# Altium schematic sheet MB2146-07-E.SchDoc
size A2
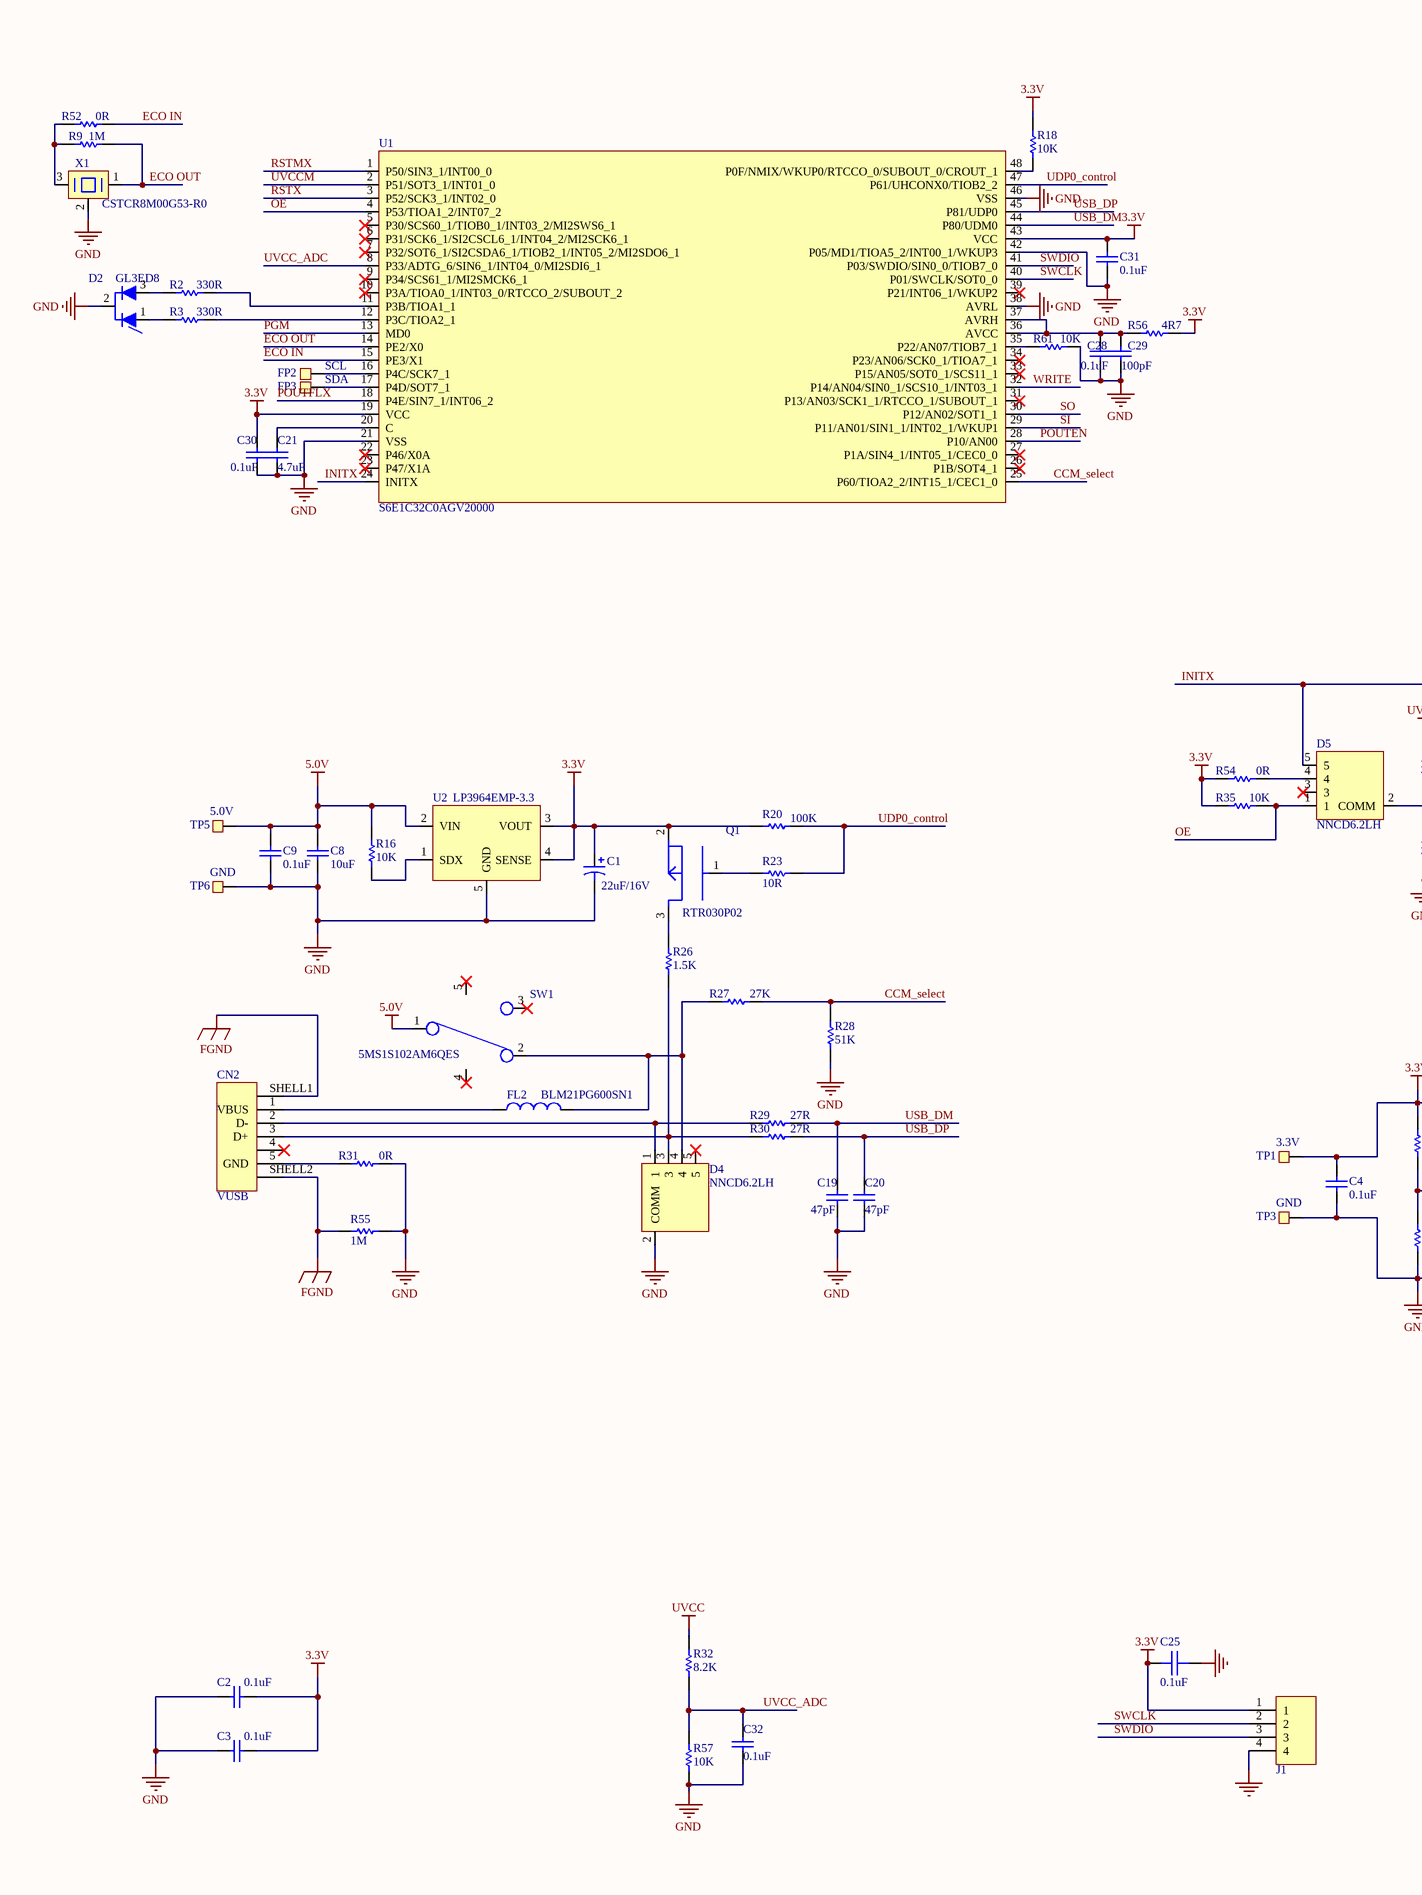
[diagram p0: MB2146-07-E.SchDoc, left]
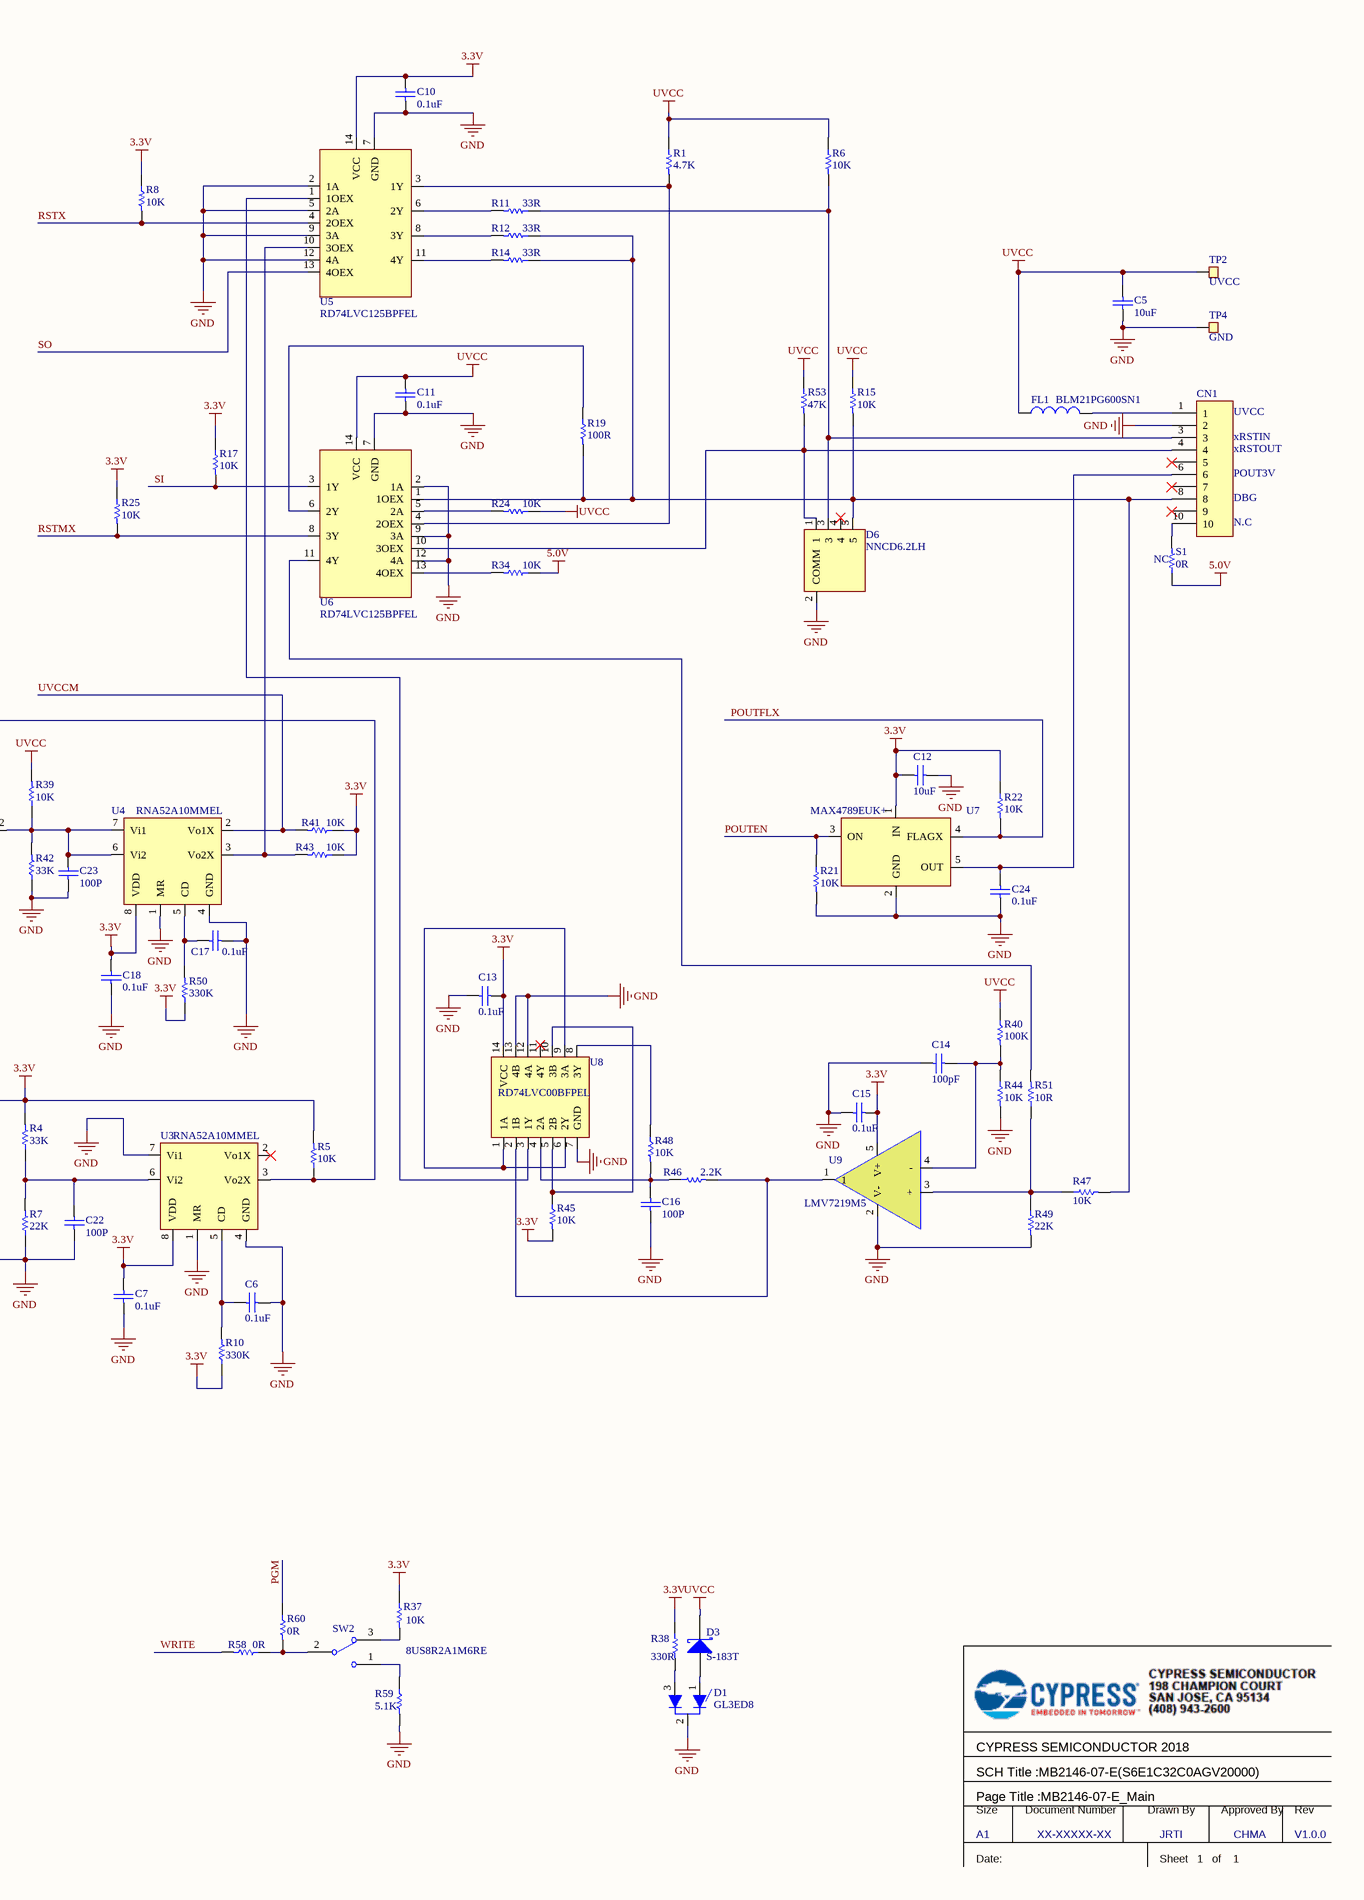
[diagram p1: MB2146-07-E.SchDoc, right]

## Parts
C1  value 22uF/16V  [EMVS_E46]  (hidden comment: Cap Pol3)
C2  value 0.1uF  [0603]  (hidden comment: Cap)
C3  value 0.1uF  [0603]  (hidden comment: Cap)
C4  value 0.1uF  [0603]  (hidden comment: Cap)
C5  value 10uF  [1206]  (hidden comment: Cap)
C6  value 0.1uF  [0603]  (hidden comment: Cap)
C7  value 0.1uF  [0603]  (hidden comment: Cap)
C8  value 10uF  [1206]  (hidden comment: Cap)
C9  value 0.1uF  [0603]  (hidden comment: Cap)
C10  value 0.1uF  [C0603]  (hidden comment: Cap)
C11  value 0.1uF  [0603]  (hidden comment: Cap)
C12  value 10uF  [1206]  (hidden comment: Cap)
C13  value 0.1uF  [0603]  (hidden comment: Cap)
C14  value 100pF  [0603]  (hidden comment: Cap)
C15  value 0.1uF  [0603]  (hidden comment: Cap)
C16  value 100P  [0603]  (hidden comment: Cap)
C17  value 0.1uF  [0603]  (hidden comment: Cap)
C18  value 0.1uF  [0603]  (hidden comment: Cap)
C19  value 47pF  [0603]  (hidden comment: Cap)
C20  value 47pF  [0603]  (hidden comment: Cap)
C21  value 4.7uF  [0603]  (hidden comment: Cap)
C22  value 100P  [0603]  (hidden comment: Cap)
C23  value 100P  [0603]  (hidden comment: Cap)
C24  value 0.1uF  [0603]  (hidden comment: Cap)
C25  0.1uF  [0603]
C28  value 0.1uF  [0603]  (hidden comment: Cap)
C29  value 100pF  [0603]  (hidden comment: Cap)
C30  value 0.1uF  [0603]  (hidden comment: Cap)
C31  value 0.1uF  [0603]  (hidden comment: Cap)
C32  value 0.1uF  [0603]  (hidden comment: Cap)
CN1  Header 10H  [FAP-10-08]  (value not drawn)
CN2  VUSB  [USB_CN01]
D1  GL3ED8  [GL3ED8]
D2  GL3ED8  [GL3ED8]
D3  S-183T  [S_183T]
D4  NNCD6.2LH  [NNCD6_2LH]
D5  NNCD6.2LH  [NNCD6_2LH]
D6  NNCD6.2LH  [NNCD6_2LH]
FL1  BLM21PG600SN1  [0805]
FL2  BLM21PG600SN1  [0805]
FP2  SCL  [TP_8G]
FP3  SDA  [TP_8G]
J1  J1  [SWD_4_2.54]  (value not drawn)
Q1  RTR030P02  [TSMT3_0]
R1  value 4.7K  [0603]  (hidden comment: Res1)
R2  value 330R  [0603]  (hidden comment: Res1)
R3  value 330R  [0603]  (hidden comment: Res1)
R4  value 33K  [0603]  (hidden comment: Res1)
R5  value 10K  [0603]  (hidden comment: Res1)
R6  value 10K  [0603]  (hidden comment: Res1)
R7  value 22K  [0603]  (hidden comment: Res1)
R8  value 10K  [0603]  (hidden comment: Res1)
R9  value 1M  [0603]  (hidden comment: Res1)
R10  value 330K  [0603]  (hidden comment: Res1)
R11  value 33R  [0603]  (hidden comment: Res1)
R12  value 33R  [0603]  (hidden comment: Res1)
R14  value 33R  [0603]  (hidden comment: Res1)
R15  value 10K  [0603]  (hidden comment: Res1)
R16  value 10K  [0603]  (hidden comment: Res1)
R17  value 10K  [0603]  (hidden comment: Res1)
R18  value 10K  [0603]  (hidden comment: Res1)
R19  value 100R  [0603]  (hidden comment: Res1)
R20  value 100K  [0603]  (hidden comment: Res1)
R21  value 10K  [0603]  (hidden comment: Res1)
R22  value 10K  [0603]  (hidden comment: Res1)
R23  value 10R  [0603]  (hidden comment: Res1)
R24  value 10K  [0603]  (hidden comment: Res1)
R25  value 10K  [0603]  (hidden comment: Res1)
R26  value 1.5K  [0603]  (hidden comment: Res1)
R27  value 27K  [0603]  (hidden comment: Res1)
R28  value 51K  [0603]  (hidden comment: Res1)
R29  value 27R  [0603]  (hidden comment: Res1)
R30  value 27R  [0603]  (hidden comment: Res1)
R31  value 0R  [0603]  (hidden comment: Res1)
R32  value 8.2K  [0603]  (hidden comment: Res1)
R34  value 10K  [0603]  (hidden comment: Res1)
R35  value 10K  [0603]  (hidden comment: Res1)
R37  value 10K  [0603]  (hidden comment: Res1)
R38  value 330R  [0603]  (hidden comment: Res1)
R39  value 10K  [0603]  (hidden comment: Res1)
R40  value 100K  [0603]  (hidden comment: Res1)
R41  value 10K  [0603]  (hidden comment: Res1)
R42  value 33K  [0603]  (hidden comment: Res1)
R43  value 10K  [0603]  (hidden comment: Res1)
R44  value 10K  [0603]  (hidden comment: Res1)
R45  value 10K  [0603]  (hidden comment: Res1)
R46  value 2.2K  [0603]  (hidden comment: Res1)
R47  value 10K  [0603]  (hidden comment: Res1)
R48  value 10K  [0603]  (hidden comment: Res1)
R49  value 22K  [0603]  (hidden comment: Res1)
R50  value 330K  [0603]  (hidden comment: Res1)
R51  value 10R  [0603]  (hidden comment: Res1)
R52  value 0R  [0603]  (hidden comment: Res1)
R53  value 47K  [0603]  (hidden comment: Res1)
R54  value 0R  [0603]  (hidden comment: Res1)
R55  value 1M  [0603]  (hidden comment: Res1)
R56  value 4R7  [0603]  (hidden comment: Res1)
R57  value 10K  [0603]  (hidden comment: Res1)
R58  value 0R  [0603]  (hidden comment: Res1)
R59  value 5.1K  [0603]  (hidden comment: Res1)
R60  value 0R  [0603]  (hidden comment: Res1)
R61  value 10K  [0603]  (hidden comment: Res1)
S1  NC  value 0R  [FFC_2]
SW1  5MS1S102AM6QES  [5MS1S102AM6QES]
SW2  8US8R2A1M6RE  [M6RE]
TP1  3.3V  [TP_8G]
TP2  UVCC  [TP_8G]
TP3  GND  [TP_8G]
TP4  GND  [TP_8G]
TP5  5.0V  [TP_8G]
TP6  GND  [TP_8G]
U1  S6E1C32C0AGV20000  [LQFP48]
U2  LP3964EMP-3.3  [SOT223_5]
U3  RNA52A10MMEL  [SOP8]
U4  RNA52A10MMEL  [SOP8]
U5  RD74LVC125BPFEL  [SOP14]
U6  RD74LVC125BPFEL  [SOP14]
U7  MAX4789EUK+  [SOT23_5L]
U8  RD74LVC00BFPEL  [SOP14]
U9  LMV7219M5  [SOT23_5]
X1  CSTCR8M00G53-R0  [CSTCR]

## Nets
3.3V: C1.1 C2.2 C3.2 C4.2 C7.2 C10.1 C12.2 C13.2 C15.2 C18.1 C25.1 C30.2 C31.2 J1.1 Q1.2 R4.2 R5.2 R8.1 R10.1 R17.1 R18.2 R20.2 R22.1 R25.1 R35.1 R37.1 R38.1 R41.1 R43.1 R45.2 R50.1 R54.2 R56.1 TP1.?1 U1.19(VCC) U1.43(VCC) U2.3(VOUT) U2.4(SENSE) U3.8(VDD) U4.8(VDD) U5.14(VCC) U7.1(IN) U8.14(VCC) U9.5(V+)
5.0V: C8.2 C9.2 R16.2 R34.1 S1.1 SW1.1 TP5.?1 U2.2(VIN)
FGND: CN2.SHELL1 CN2.SHELL2 R55.2
GND: C1.2 C2.1 C3.1 C4.1 C5.2 C6.1 C7.1 C8.1 C9.1 C10.2 C11.2 C12.1 C13.1 C14.1 C15.1 C16.1 C17.1 C18.2 C19.1 C20.1 C21.1 C22.1 C23.1 C24.2 C25.2 C28.1 C29.1 C30.1 C31.1 C32.1 CN1.2 D1.2 D2.2 D4.2(COMM) D6.2(COMM) J1.4 R7.1 R21.2 R28.2 R31.1 R42.1 R44.2 R49.2 R55.1 R57.1 R59.2 R61.1 TP3.?1 TP4.?1 TP6.?1 U1.21(VSS) U1.38(AVRL) U1.42(P05/MD1/TIOA5_2/INT00_1/WKUP3) U1.46(VSS) U2.5(GND) U3.1(MR) U3.4(GND) U3.7(Vi1) U4.1(MR) U4.4(GND) U5.2(1A) U5.5(2A) U5.7(GND) U5.9(3A) U5.12(4A) U6.2(1A) U6.7(GND) U6.9(3A) U6.12(4A) U7.2(GND) U8.7(GND) U8.12(4A) U8.13(4B) U9.2(V-) X1.2
UVCC: C5.1 C11.1 D3.2(K) FL1.1 R1.1 R6.1 R15.1 R24.1 R32.2 R39.2 R40.1 R53.1 TP2.?1 U6.14(VCC)
CCM_select: R27.2 R28.1 U1.25(P60/TIOA2_2/INT15_1/CEC1_0)
ECO IN: R52.1 U1.15(PE3/X1)
ECO OUT: R9.1 U1.14(PE2/X0) X1.1
INITX: D5.5 R5.1 U1.24(INITX) U3.3(Vo2X)
OE: D5.1 R35.2 U1.4(P53/TIOA1_2/INT07_2)
PGM: R60.1 U1.13(MD0)
POUTEN: R21.1 U1.28(P10/AN00) U7.3(ON)
POUTFLX: R22.2 U1.18(P4E/SIN7_1/INT06_2) U7.4(FLAGX)
RSTMX: R25.2 U1.1(P50/SIN3_1/INT00_0) U6.8(3Y)
RSTX: R8.2 U1.3(P52/SCK3_1/INT02_0) U5.4(2OEX)
SI: R17.2 U1.29(P11/AN01/SIN1_1/INT02_1/WKUP1) U6.3(1Y)
SO: U1.30(P12/AN02/SOT1_1) U5.13(4OEX)
SWCLK: J1.2 U1.40(P01/SWCLK/SOT0_0)
SWDIO: J1.3 U1.41(P03/SWDIO/SIN0_0/TIOB7_0)
UDP0_control: R20.1 R23.1 U1.47(P61/UHCONX0/TIOB2_2)
USB_DM: C19.2 R29.1 U1.44(P80/UDM0)
USB_DP: C20.2 R30.1 U1.45(P81/UDP0)
UVCC_ADC: C32.2 R32.1 R57.2 U1.8(P33/ADTG_6/SIN6_1/INT04_0/MI2SDI6_1)
UVCCM: R41.2 U1.2(P51/SOT3_1/INT01_0) U4.2(Vo1X)
WRITE: R58.2 U1.32(P14/AN04/SIN0_1/SCS10_1/INT03_1)
NetC6_2: C6.2 R10.2 U3.5(CD)
NetC14_2: C14.2 R40.2 R44.1 U9.4(-)
NetC16_2: C16.2 R46.1 R48.2 U8.4(2A)
NetC17_2: C17.2 R50.2 U4.5(CD)
NetC21_2: C21.2 U1.20(C)
NetC22_2: C22.2 R4.1 R7.2 U3.6(Vi2)
NetC23_2: C23.2 D5.2(COMM) R39.1 R42.2 U4.6(Vi2) U4.7(Vi1)
NetC24_1: C24.1 CN1.6 U7.5(OUT)
NetC28_2: C28.2 C29.2 R56.2 U1.36(AVCC) U1.37(AVRH)
NetCN1_1: CN1.1 FL1.2
NetCN1_3: CN1.3 D6.3 R6.2 R11.1
NetCN1_4: CN1.4 D6.1 R53.2 U6.10(3OEX)
NetCN1_8: CN1.8 D6.5 R12.1 R14.1 R15.2 R19.2 R47.2 U6.1(1OEX)
NetCN1_10: CN1.10 S1.2
NetCN2_1: CN2.1(VBUS) FL2.1
NetCN2_2: CN2.2(D-) D4.1 R29.2
NetCN2_3: CN2.3(D+) D4.3 R26.2 R30.2
NetCN2_5: CN2.5(GND) R31.2
NetD1_1: D1.1 D3.1(A)
NetD1_3: D1.3 R38.2
NetD2_1: D2.1 R3.2
NetD2_3: D2.3 R2.2
NetD4_4: D4.4 FL2.2 R27.1 SW1.2
NetD5_4: D5.4 R54.1
NetFP2_?1: FP2.?1 U1.16(P4C/SCK7_1)
NetFP3_?1: FP3.?1 U1.17(P4D/SOT7_1)
NetQ1_1: Q1.1 R23.2
NetQ1_3: Q1.3 R26.1
NetR1_2: R1.2 U5.3(1Y) U6.4(2OEX)
NetR2_1: R2.1 U1.11(P3B/TIOA1_1)
NetR3_1: R3.1 U1.12(P3C/TIOA2_1)
NetR9_2: R9.2 R52.2 X1.3
NetR11_2: R11.2 U5.6(2Y)
NetR12_2: R12.2 U5.8(3Y)
NetR14_2: R14.2 U5.11(4Y)
NetR16_1: R16.1 U2.1(SDX)
NetR18_1: R18.1 U1.48(P0F/NMIX/WKUP0/RTCCO_0/SUBOUT_0/CROUT_1)
NetR19_1: R19.1 U6.6(2Y)
NetR24_2: R24.2 U6.5(2A)
NetR34_2: R34.2 U6.13(4OEX)
NetR37_2: R37.2 SW2.3
NetR43_2: R43.2 U4.3(Vo2X) U5.10(3OEX)
NetR45_1: R45.1 U8.5(2B) U8.10(3B)
NetR46_2: R46.2 U8.2(1B) U9.1
NetR47_1: R47.1 R49.1 R51.1 U9.3(+)
NetR48_1: R48.1 U8.8(3Y)
NetR51_2: R51.2 U6.11(4Y)
NetR58_1: R58.1 R60.2 SW2.2
NetR59_1: R59.1 SW2.1
NetR61_2: R61.2 U1.35(P22/AN07/TIOB7_1)
NetU5_1: U5.1(1OEX) U8.3(1Y)
NetU8_1: U8.1(1A) U8.6(2Y) U8.9(3A)

Not connected (* = marked no-connect by the designer): CN1 5* 7* 9*; CN2 4*; D4 5*; D5 3*; D6 4*; SW1 3* 4* 5*; U1 5(P30/SCS60_1/TIOB0_1/INT03_2/MI2SWS6_1)* 6(P31/SCK6_1/SI2CSCL6_1/INT04_2/MI2SCK6_1)* 7(P32/SOT6_1/SI2CSDA6_1/TIOB2_1/INT05_2/MI2SDO6_1)* 9(P34/SCS61_1/MI2SMCK6_1)* 10(P3A/TIOA0_1/INT03_0/RTCCO_2/SUBOUT_2)* 22(P46/X0A)* 23(P47/X1A)* 26(P1B/SOT4_1)* 27(P1A/SIN4_1/INT05_1/CEC0_0)* 31(P13/AN03/SCK1_1/RTCCO_1/SUBOUT_1)* 33(P15/AN05/SOT0_1/SCS11_1)* 34(P23/AN06/SCK0_1/TIOA7_1)* 39(P21/INT06_1/WKUP2)*; U3 2(Vo1X)*; U8 11(4Y)*

## Notes on the sheet
- (near CN1) UVCC
- (near CN1) xRSTIN
- (near CN1) xRSTOUT
- (near CN1) POUT3V
- (near CN1) DBG
- (near CN1) N.C
- CYPRESS SEMICONDUCTOR 2018
- SCH Title :MB2146-07-E(S6E1C32C0AGV20000)
- Page Title :MB2146-07-E_Main
- Size
- Date:
- A1
- Document Number
- XX-XXXXX-XX
- Drawn By
- Sheet   1   of    1
- JRTI
- Approved By
- CHMA
- Rev
- V1.0.0

## Library data of the parts
C1 = Cap Pol3: Polarized Capacitor (Surface Mount); Published: 8-Jun-2000; LatestRevisionDate: 17-Jul-2002; LatestRevisionNote: Re-released for DXP Platform.; PackageReference: C0805; Publisher: Altium Limited
C2-C24 C28-C32 = Cap: Capacitor; Published: 8-Jun-2000; LatestRevisionDate: 17-Jul-2002; LatestRevisionNote: Re-released for DXP Platform.; PackageReference: RAD-0.3; Publisher: Altium Limited
C25 = C_no pol: Capacitor without polarity
CN1 = Header 10H: Header, 10-Pin, Right Angle; LatestRevisionDate: 17-Jul-2002; LatestRevisionNote: Re-released for DXP Platform.; Publisher: Altium Limited
CN2 = Header 7H: Header, 7-Pin, Right Angle; LatestRevisionDate: 17-Jul-2002; LatestRevisionNote: Re-released for DXP Platform.; Publisher: Altium Limited
D3 = D Schottky: Schottky Diode; Published: 8-Jun-2000; LatestRevisionDate: 17-Jul-2002; LatestRevisionNote: Re-released for DXP Platform.; PackageReference: SMB; Publisher: Altium Limited; Code_JEDEC: DO-214-AA
FL1 FL2 = Inductor: Code_IEC: 1005; Value: 10mH; Published: 8-Jun-2000; LatestRevisionDate: 17-Jul-2002; LatestRevisionNote: Re-released for DXP Platform.; PackageReference: 0402-A; Publisher: Altium Limited; Code_JEITA: 0402
FP2 FP3 TP1-TP6 = TP
J1 = Header 4: Header, 4-Pin; LatestRevisionDate: 17-Jul-2002; LatestRevisionNote: Re-released for DXP Platform.; Publisher: Altium Limited
R1-R12 R14-R32 R34 R35 R37-R61 S1 = Res1: Resistor; Published: 8-Jun-2000; LatestRevisionDate: 17-Jul-2002; LatestRevisionNote: Re-released for DXP Platform.; PackageReference: AXIAL-0.3; Publisher: Altium Limited
SW2 = SW-SPDT: SPDT Subminiature Toggle Switch, Right Angle Mounting, Vertical Actuation; Published: 24-Mar-1999; LatestRevisionDate: 17-Dec-2003; LatestRevisionNote: Schematic revised, PCB Footprint replaced.; DatasheetDocument: 05-Dec-2000; PackageReference: TL36WW15050; Publisher: Altium Limited; ComponentLink1Description: Manufacturer Link; ComponentLink1URL: http://www.apem.com
X1 = CSTCR4M00G15L99